# EAGLE schematic OBCv1_18_2_12 - Copy (EAGLE 5.10)
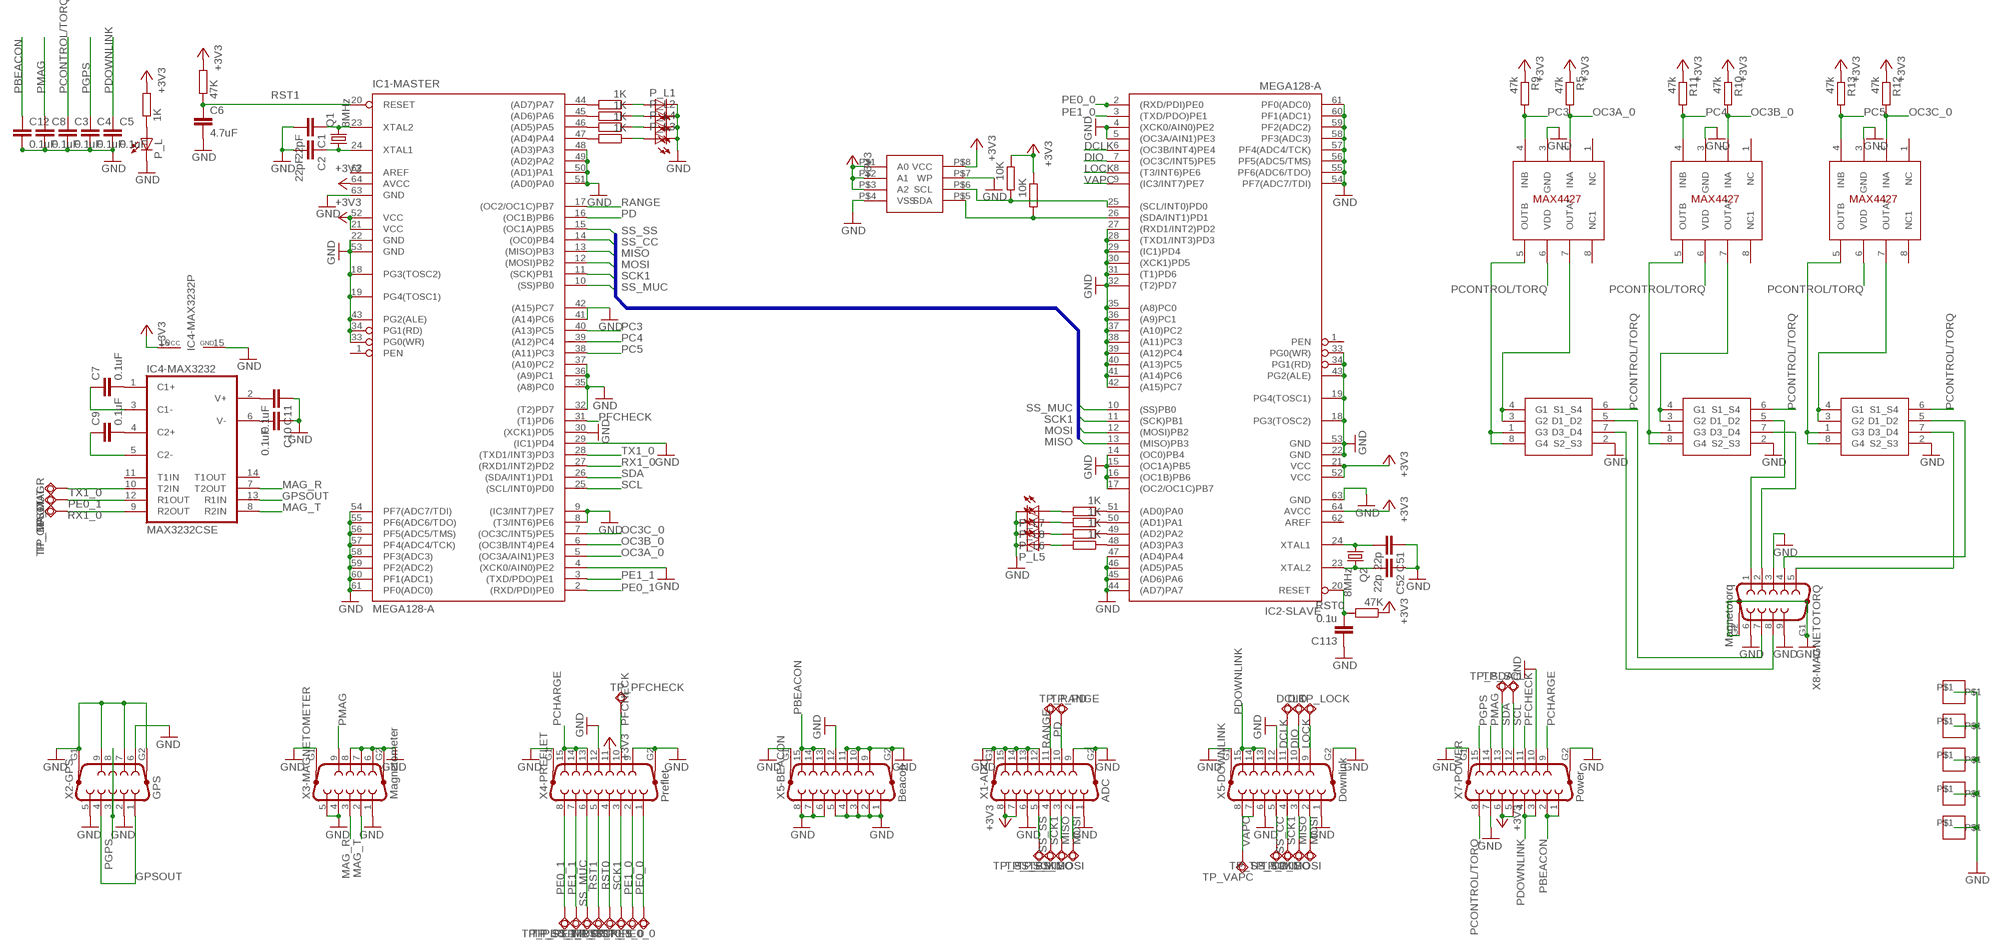
[diagram p0: schematic, sheet 1]

## Parts
C1  22pF  C-EUC1206  [C1206]
C2  22pF  C-EUC1206  [C1206]
C3  0.1uF  C-EUC1206  [C1206]
C4  0.1uF  C-EUC1206  [C1206]
C5  0.1uF  C-EUC1206  [C1206]
C6  4.7uF  C-EUC1206  [C1206]
C7  0.1uF  C-EUC1206  [C1206]
C8  0.1uF  C-EUC1206  [C1206]
C9  0.1uF  C-EUC1206  [C1206]
C10  0.1uF  C-EUC1206  [C1206]
C11  0.1uF  C-EUC1206  [C1206]
C12  0.1uF  C-EUC1206  [C1206]
C51  22p  C-EUC1206  [C1206]
C52  22p  C-EUC1206  [C1206]
C113  0.1u  C-EUC1206  [C1206]
DCLK  TPSQTP12R  [TP12R]
DIO  TPSQTP12R  [TP12R]
IC1-MASTER  MEGA128-A  [TQFP64]
IC2-SLAVE  MEGA128-A  [TQFP64]
IC3-EEPROM  24FC1025  [24FC1025]
IC4-MAX3232  MAX3232CSE  [SO16]
IC5  MAX4427SO  [SO08]
IC6  MAX4427SO  [SO08]
IC7  MAX4427SO  [SO08]
IC8  ZXMHC3A01T8  [SM8]
IC9  ZXMHC3A01T8  [SM8]
IC10  ZXMHC3A01T8  [SM8]
P_L  LEDCHIPLED_1206  [CHIPLED_1206]
P_L1  LEDCHIPLED_1206  [CHIPLED_1206]
P_L2  LEDCHIPLED_1206  [CHIPLED_1206]
P_L3  LEDCHIPLED_1206  [CHIPLED_1206]
P_L4  LEDCHIPLED_1206  [CHIPLED_1206]
P_L5  LEDCHIPLED_1206  [CHIPLED_1206]
P_L6  LEDCHIPLED_1206  [CHIPLED_1206]
P_L7  LEDCHIPLED_1206  [CHIPLED_1206]
P_L8  LEDCHIPLED_1206  [CHIPLED_1206]
P_R  1K  R-EU_M1206  [M1206]
P_R1  1K  R-EU_M1206  [M1206]
P_R2  1K  R-EU_M1206  [M1206]
P_R3  1K  R-EU_M1206  [M1206]
P_R4  1K  R-EU_M1206  [M1206]
P_R5  1K  R-EU_M1206  [M1206]
P_R6  1K  R-EU_M1206  [M1206]
P_R7  1K  R-EU_M1206  [M1206]
P_R8  1K  R-EU_M1206  [M1206]
Q1  8MHz  CRYSTALHC49S  [HC49/S]
Q2  8MHz  CRYSTALHC49S  [HC49/S]
R5  47k  R-EU_M1206  [M1206]
R9  47k  R-EU_M1206  [M1206]
R10  47k  R-EU_M1206  [M1206]
R11  47k  R-EU_M1206  [M1206]
R12  47k  R-EU_M1206  [M1206]
R13  47k  R-EU_M1206  [M1206]
R51  10K  R-EU_M1206  [M1206]
R52  10K  R-EU_M1206  [M1206]
R53  47K  R-EU_M1206  [M1206]
R113  47K  R-EU_M1206  [M1206]
TP__MISO  TPSQTP12R  [TP12R]
TP__MOSI  TPSQTP12R  [TP12R]
TP__SCK1  TPSQTP12R  [TP12R]
TP_GPSOUT  TPSQTP12R  [TP12R]
TP_LOCK  TPSQTP12R  [TP12R]
TP_MAGR  TPSQTP12R  [TP12R]
TP_MAGT  TPSQTP12R  [TP12R]
TP_MISO  TPSQTP12R  [TP12R]
TP_MOSI  TPSQTP12R  [TP12R]
TP_PD  TPSQTP12R  [TP12R]
TP_PE0_0  TPSQTP12R  [TP12R]
TP_PE0_1  TPSQTP12R  [TP12R]
TP_PE1_0  TPSQTP12R  [TP12R]
TP_PE1_1  TPSQTP12R  [TP12R]
TP_PFCHECK  TPSQTP12R  [TP12R]
TP_RANGE  TPSQTP12R  [TP12R]
TP_RST0  TPSQTP12R  [TP12R]
TP_RST1  TPSQTP12R  [TP12R]
TP_SCK1  TPSQTP12R  [TP12R]
TP_SCK_S  TPSQTP12R  [TP12R]
TP_SCL  TPSQTP12R  [TP12R]
TP_SDA  TPSQTP12R  [TP12R]
TP_SS_CC  TPSQTP12R  [TP12R]
TP_SS_MUC  TPSQTP12R  [TP12R]
TP_SS_SS  TPSQTP12R  [TP12R]
TP_VAPC  TPSQTP12R  [TP12R]
U$1  MOUNT_SQ  [MOUNT_10MM]
U$9  MOUNT_SQ  [MOUNT_10MM]
U$10  MOUNT_SQ  [MOUNT_10MM]
U$11  MOUNT_SQ  [MOUNT_10MM]
U$12  MOUNT_SQ  [MOUNT_10MM]
X1-ADC  ADC  F15HP  [F15HP]
X2-GPS  GPS  F09HP  [F09HP]
X3-MAGNETOMETER  Magnetometer  F09HP  [F09HP]
X4-PREFLET  Preflet  F15HP  [F15HP]
X5-BEACON  Beacon  F15HP  [F15HP]
X5-DOWNLINK  Downlink  F15HP  [F15HP]
X7-POWER  Power  F15HP  [F15HP]
X8-MAGNETOTORQ  Magnetotorq  F09HP  [F09HP]

## Nets
+3V3 [Power]: IC1-MASTER.21(VCC) IC1-MASTER.52(VCC) IC1-MASTER.64(AVCC) IC2-SLAVE.21(VCC) IC2-SLAVE.52(VCC) IC2-SLAVE.64(AVCC) IC3-EEPROM.P$1(A0) IC3-EEPROM.P$2(A1) IC3-EEPROM.P$3(A2) IC3-EEPROM.P$8(VCC) IC4-MAX3232.16(VCC) P_R.2 R5.1 R9.1 R10.1 R11.1 R12.1 R13.1 R51.1 R52.1 R53.2 R113.1 X1-ADC.7 X1-ADC.8 X4-PREFLET.11 X7-POWER.5 X7-POWER.6
DCLK: DCLK.TP IC2-SLAVE.6((OC3B/INT4)PE4) X5-DOWNLINK.11
DIO: DIO.TP IC2-SLAVE.7((OC3C/INT5)PE5) X5-DOWNLINK.10
GND [Power]: C1.2 C2.2 C3.2 C4.2 C5.2 C6.2 C8.2 C10.1 C11.1 C12.2 C51.1 C52.1 C113.1 IC1-MASTER.4((XCK0/AIN0)PE2) IC1-MASTER.8((T3/INT6)PE6) IC1-MASTER.9((IC3/INT7)PE7) IC1-MASTER.18(PG3(TOSC2)) IC1-MASTER.19(PG4(TOSC1)) IC1-MASTER.22(GND) IC1-MASTER.29((IC1)PD4) IC1-MASTER.30((XCK1)PD5) IC1-MASTER.32((T2)PD7) IC1-MASTER.33(PG0(WR)) IC1-MASTER.34(PG1(RD)) IC1-MASTER.35((A8)PC0) IC1-MASTER.36((A9)PC1) IC1-MASTER.37((A10)PC2) IC1-MASTER.41((A14)PC6) IC1-MASTER.42((A15)PC7) IC1-MASTER.43(PG2(ALE)) IC1-MASTER.48((AD3)PA3) IC1-MASTER.49((AD2)PA2) IC1-MASTER.50((AD1)PA1) IC1-MASTER.51((AD0)PA0) IC1-MASTER.53(GND) IC1-MASTER.54(PF7(ADC7/TDI)) IC1-MASTER.55(PF6(ADC6/TDO)) IC1-MASTER.56(PF5(ADC5/TMS)) IC1-MASTER.57(PF4(ADC4/TCK)) IC1-MASTER.58(PF3(ADC3)) IC1-MASTER.59(PF2(ADC2)) IC1-MASTER.60(PF1(ADC1)) IC1-MASTER.61(PF0(ADC0)) IC1-MASTER.63(GND) IC2-SLAVE.4((XCK0/AIN0)PE2) IC2-SLAVE.5((OC3A/AIN1)PE3) IC2-SLAVE.14((OC0)PB4) IC2-SLAVE.15((OC1A)PB5) IC2-SLAVE.16((OC1B)PB6) IC2-SLAVE.17((OC2/OC1C)PB7) IC2-SLAVE.18(PG3(TOSC2)) IC2-SLAVE.19(PG4(TOSC1)) IC2-SLAVE.22(GND) IC2-SLAVE.27((RXD1/INT2)PD2) IC2-SLAVE.28((TXD1/INT3)PD3) IC2-SLAVE.29((IC1)PD4) IC2-SLAVE.30((XCK1)PD5) IC2-SLAVE.31((T1)PD6) IC2-SLAVE.32((T2)PD7) IC2-SLAVE.33(PG0(WR)) IC2-SLAVE.34(PG1(RD)) IC2-SLAVE.35((A8)PC0) IC2-SLAVE.36((A9)PC1) IC2-SLAVE.37((A10)PC2) IC2-SLAVE.38((A11)PC3) IC2-SLAVE.39((A12)PC4) IC2-SLAVE.40((A13)PC5) IC2-SLAVE.41((A14)PC6) IC2-SLAVE.42((A15)PC7) IC2-SLAVE.43(PG2(ALE)) IC2-SLAVE.44((AD7)PA7) IC2-SLAVE.45((AD6)PA6) IC2-SLAVE.46((AD5)PA5) IC2-SLAVE.47((AD4)PA4) IC2-SLAVE.53(GND) IC2-SLAVE.54(PF7(ADC7/TDI)) IC2-SLAVE.55(PF6(ADC6/TDO)) IC2-SLAVE.56(PF5(ADC5/TMS)) IC2-SLAVE.57(PF4(ADC4/TCK)) IC2-SLAVE.58(PF3(ADC3)) IC2-SLAVE.59(PF2(ADC2)) IC2-SLAVE.60(PF1(ADC1)) IC2-SLAVE.61(PF0(ADC0)) IC2-SLAVE.63(GND) IC3-EEPROM.P$4(VSS) IC3-EEPROM.P$7(WP) IC4-MAX3232.15(GND) IC5.3(GND) IC6.3(GND) IC7.3(GND) IC8.2(S2_S3) IC9.2(S2_S3) IC10.2(S2_S3) P_L1.C P_L2.C P_L3.C P_L4.C P_L5.C P_L6.C P_L7.C P_L8.C P_L.C U$1.P$1 U$9.P$1 U$10.P$1 U$11.P$1 U$12.P$1 X1-ADC.1 X1-ADC.6 X1-ADC.9 X1-ADC.12 X1-ADC.13 X1-ADC.14 X1-ADC.15 X1-ADC.G1 X1-ADC.G2 X2-GPS.2 X2-GPS.5 X2-GPS.6 X2-GPS.7 X2-GPS.9 X2-GPS.G1 X2-GPS.G2 X3-MAGNETOMETER.1 X3-MAGNETOMETER.4 X3-MAGNETOMETER.5 X3-MAGNETOMETER.6 X3-MAGNETOMETER.7 X3-MAGNETOMETER.8 X3-MAGNETOMETER.G1 X3-MAGNETOMETER.G2 X4-PREFLET.9 X4-PREFLET.12 X4-PREFLET.G1 X4-PREFLET.G2 X5-BEACON.1 X5-BEACON.2 X5-BEACON.3 X5-BEACON.4 X5-BEACON.5 X5-BEACON.6 X5-BEACON.7 X5-BEACON.8 X5-BEACON.9 X5-BEACON.10 X5-BEACON.11 X5-BEACON.12 X5-BEACON.G1 X5-BEACON.G2 X5-DOWNLINK.1 X5-DOWNLINK.6 X5-DOWNLINK.12 X5-DOWNLINK.G1 X5-DOWNLINK.G2 X7-POWER.7 X7-POWER.10 X7-POWER.G1 X7-POWER.G2 X8-MAGNETOTORQ.3 X8-MAGNETOTORQ.6 X8-MAGNETOTORQ.9 X8-MAGNETOTORQ.G1 X8-MAGNETOTORQ.G2
GPSOUT: IC4-MAX3232.13(R1IN) X2-GPS.1 X2-GPS.4
LOCK: IC2-SLAVE.8((T3/INT6)PE6) TP_LOCK.TP X5-DOWNLINK.9
MAG_R: IC4-MAX3232.7(T2OUT) X3-MAGNETOMETER.3
MAG_T: IC4-MAX3232.8(R2IN) X3-MAGNETOMETER.2
MISO: IC1-MASTER.13((MISO)PB3) IC2-SLAVE.13((MISO)PB3) TP__MISO.TP TP_MISO.TP X1-ADC.3 X5-DOWNLINK.3
MOSI: IC1-MASTER.12((MOSI)PB2) IC2-SLAVE.12((MOSI)PB2) TP__MOSI.TP TP_MOSI.TP X1-ADC.2 X5-DOWNLINK.2
N$1: C1.1 IC1-MASTER.23(XTAL2) Q1.2
N$2: C2.1 IC1-MASTER.24(XTAL1) Q1.1
N$3: P_L.A P_R.1
N$8: P_L1.A P_R1.1
N$9: IC1-MASTER.44((AD7)PA7) P_R1.2
N$10: IC1-MASTER.45((AD6)PA6) P_R2.2
N$11: IC5.7(OUTA*) IC8.3(G2) IC8.4(G1)
N$12: C52.2 IC2-SLAVE.23(XTAL2) Q2.2
N$13: C51.2 IC2-SLAVE.24(XTAL1) Q2.1
N$15: IC7.5(OUTB) IC10.1(G3) IC10.8(G4)
N$19: IC2-SLAVE.25((SCL/INT0)PD0) IC3-EEPROM.P$6(SCL) R52.2
N$20: IC2-SLAVE.26((SDA/INT1)PD1) IC3-EEPROM.P$5(SDA) R51.2
N$21: P_L2.A P_R2.1
N$22: IC1-MASTER.46((AD5)PA5) P_R3.2
N$23: P_L4.A P_R3.1
N$24: IC1-MASTER.47((AD4)PA4) P_R4.2
N$25: P_L3.A P_R4.1
N$26: P_L7.A P_R5.2
N$27: IC2-SLAVE.51((AD0)PA0) P_R5.1
N$28: IC2-SLAVE.50((AD1)PA1) P_R6.1
N$29: C7.2 IC4-MAX3232.1(C1+)
N$30: C7.1 IC4-MAX3232.3(C1-)
N$31: C9.2 IC4-MAX3232.4(C2+)
N$32: C9.1 IC4-MAX3232.5(C2-)
N$33: C11.2 IC4-MAX3232.2(V+)
N$34: C10.2 IC4-MAX3232.6(V-)
N$35: P_L8.A P_R6.2
N$36: IC2-SLAVE.49((AD2)PA2) P_R7.1
N$37: P_L6.A P_R7.2
N$38: IC2-SLAVE.48((AD3)PA3) P_R8.1
N$39: P_L5.A P_R8.2
N$44: IC8.5(D1_D2) X8-MAGNETOTORQ.7
N$50: IC8.7(D3_D4) X8-MAGNETOTORQ.8
N$51: IC5.5(OUTB) IC8.1(G3) IC8.8(G4)
N$52: IC6.7(OUTA*) IC9.3(G2) IC9.4(G1)
N$56: IC9.5(D1_D2) X8-MAGNETOTORQ.1
N$57: IC9.7(D3_D4) X8-MAGNETOTORQ.2
N$61: IC6.5(OUTB) IC9.1(G3) IC9.8(G4)
N$62: IC7.7(OUTA*) IC10.3(G2) IC10.4(G1)
N$66: IC10.5(D1_D2) X8-MAGNETOTORQ.4
N$67: IC10.7(D3_D4) X8-MAGNETOTORQ.5
OC3A_0: IC1-MASTER.5((OC3A/AIN1)PE3) IC5.2(INA) R5.2
OC3B_0: IC1-MASTER.6((OC3B/INT4)PE4) IC6.2(INA) R10.2
OC3C_0: IC1-MASTER.7((OC3C/INT5)PE5) IC7.2(INA) R12.2
PBEACON [Power]: C12.1 X5-BEACON.13 X5-BEACON.14 X5-BEACON.15 X7-POWER.1 X7-POWER.2
PC3: IC1-MASTER.40((A13)PC5) IC5.4(INB) R9.2
PC4: IC1-MASTER.39((A12)PC4) IC6.4(INB) R11.2
PC5: IC1-MASTER.38((A11)PC3) IC7.4(INB) R13.2
PCHARGE [Power]: X4-PREFLET.13 X4-PREFLET.14 X4-PREFLET.15 X7-POWER.9
PCONTROL/TORQ [Power]: C3.1 IC5.6(VDD) IC6.6(VDD) IC7.6(VDD) IC8.6(S1_S4) IC9.6(S1_S4) IC10.6(S1_S4) X7-POWER.8
PD: IC1-MASTER.16((OC1B)PB6) TP_PD.TP X1-ADC.10
PDOWNLINK [Power]: C5.1 X5-DOWNLINK.13 X5-DOWNLINK.14 X5-DOWNLINK.15 X7-POWER.3 X7-POWER.4
PE0_0: IC2-SLAVE.2((RXD/PDI)PE0) TP_PE0_0.TP X4-PREFLET.1
PE0_1: IC1-MASTER.2((RXD/PDI)PE0) IC4-MAX3232.12(R1OUT) TP_GPSOUT.TP TP_PE0_1.TP X4-PREFLET.8
PE1_0: IC2-SLAVE.3((TXD/PDO)PE1) TP_PE1_0.TP X4-PREFLET.2
PE1_1: IC1-MASTER.3((TXD/PDO)PE1) TP_PE1_1.TP X4-PREFLET.7
PFCHECK: IC1-MASTER.31((T1)PD6) TP_PFCHECK.TP X4-PREFLET.10 X7-POWER.11
PGPS [Power]: C4.1 X2-GPS.3 X2-GPS.8 X7-POWER.15
PMAG [Power]: C8.1 X3-MAGNETOMETER.9 X7-POWER.14
RANGE: IC1-MASTER.17((OC2/OC1C)PB7) TP_RANGE.TP X1-ADC.11
RST0: C113.2 IC2-SLAVE.20(RESET) R113.2 TP_RST0.TP X4-PREFLET.4
RST1: C6.1 IC1-MASTER.20(RESET) R53.1 TP_RST1.TP X4-PREFLET.5
RX1_0: IC1-MASTER.27((RXD1/INT2)PD2) IC4-MAX3232.9(R2OUT) TP_MAGT.TP
SCK1: IC1-MASTER.11((SCK)PB1) IC2-SLAVE.11((SCK)PB1) TP__SCK1.TP TP_SCK1.TP TP_SCK_S.TP X1-ADC.4 X4-PREFLET.3 X5-DOWNLINK.4
SCL: IC1-MASTER.25((SCL/INT0)PD0) TP_SCL.TP X7-POWER.12
SDA: IC1-MASTER.26((SDA/INT1)PD1) TP_SDA.TP X7-POWER.13
SS_CC: IC1-MASTER.14((OC0)PB4) TP_SS_CC.TP X5-DOWNLINK.5
SS_MUC: IC1-MASTER.10((SS)PB0) IC2-SLAVE.10((SS)PB0) TP_SS_MUC.TP X4-PREFLET.6
SS_SS: IC1-MASTER.15((OC1A)PB5) TP_SS_SS.TP X1-ADC.5
TX1_0: IC1-MASTER.28((TXD1/INT3)PD3) IC4-MAX3232.10(T2IN) TP_MAGR.TP
VAPC: IC2-SLAVE.9((IC3/INT7)PE7) TP_VAPC.TP X5-DOWNLINK.7 X5-DOWNLINK.8
Unconnected: IC1-MASTER.1(PEN) IC1-MASTER.62(AREF) IC2-SLAVE.1(PEN) IC2-SLAVE.62(AREF) IC4-MAX3232.11(T1IN) IC4-MAX3232.14(T1OUT) IC5.1(NC) IC5.8(NC1) IC6.1(NC) IC6.8(NC1) IC7.1(NC) IC7.8(NC1)

## Buses
SS_SS,SCK1,MOSI,MISO,SS_MUC,SS_CC

## Library data of the parts
C1-C12 C51 C52 C113 = rcl:C-EU: CAPACITOR, European symbol
DCLK DIO TP__MISO TP__MOSI TP__SCK1 TP_GPSOUT TP_LOCK TP_MAGR TP_MAGT TP_MISO TP_MOSI TP_PD TP_PE0_0 TP_PE0_1 TP_PE1_0 TP_PE1_1 TP_PFCHECK TP_RANGE TP_RST0 TP_RST1 TP_SCK1 TP_SCK_S TP_SCL TP_SDA TP_SS_CC TP_SS_MUC TP_SS_SS TP_VAPC = testpad:TPSQ: Test pad
IC1-MASTER IC2-SLAVE = satellite:MEGA128: MICROCONTROLLER 128 Kbytes FLASH 4 Kbytes SRAM 4 Kbytes EEPROM DUAL USART 8-channel 10 bit ADC Source: avr.lbr
IC3-EEPROM = satellite:24FC1025
IC4-MAX3232 = satellite:MAX3232*: True RS-232 Transceivers 3.0V to 5.5V, Low-Power up to 1Mbps, Using Four 0.1µF External Capacitors Source: http://pdfserv.maxim-ic.com/en/ds/MAX3222-MAX3241.pdf
IC5-IC7 = satellite:MAX4427
IC8-IC10 = satellite:ZXMHC3A01T8
P_L P_L1-P_L8 = satellite:LED: LED OSRAM: - CHIPLED LG R971, LG N971, LY N971, LG Q971, LY Q971, LO R971, LY R971 LH N974, LH R974 LS Q976, LO Q976, LY Q976 LO Q996 - Hyper CHIPLED LW Q18S LB Q993, LB Q99A, LB R99A - SideLED LS A670, LO A670, LY A670, LG A670, LP A670 LB A673, LV A673, LT A673, LW A673 LH A674 LY A675 LS A676, LA A676, LO A676, LY A676, LW A676 LS A679, LY A679, LG A679 - Hyper Micro SIDELED® LS Y876, LA Y876, LO Y876, LY Y876 LT Y87S - SmartLED LW L88C, LW L88S LB L89C, LB L89S, LG L890 LS L89K, LO L89K, LY L89K LS L896, LA L896, LO L896, LY L896 - TOPLED LS T670, LO T670, LY T670, LG T670, LP T670 LSG T670, LSP T670, LSY T670, LOP T670, LYG T670 LG T671, LOG T671, LSG T671 LB T673, LV T673, LT T673, LW T673 LH T674 LS T676, LA T676, LO T676, LY T676, LB T676, LH T676, LSB T676, LW T676 LB T67C, LV T67C, LT T67C, LS T67K, LO T67K, LY T67K, LW E67C LS E67B, LA E67B, LO E67B, LY E67B, LB E67C, LV E67C, LT E67C LW T67C LS T679, LY T679, LG T679 LS T770, LO T770, LY T770, LG T770, LP T770 LB T773, LV T773, LT T773, LW T773 LH T774 LS E675, LA E675, LY E675, LS T675 LS T776, LA T776, LO T776, LY T776, LB T776 LHGB T686 LT T68C, LB T68C - Hyper Mini TOPLED® LB M676 - Mini TOPLED Santana® LG M470 LS M47K, LO M47K, LY M47K Source: http://www.osram.convergy.de LUXEON: - LUMILED® LXK2-PW12-R00, LXK2-PW12-S00, LXK2-PW14-U00, LXK2-PW14-V00 LXK2-PM12-R00, LXK2-PM12-S00, LXK2-PM14-U00 LXK2-PE12-Q00, LXK2-PE12-R00, LXK2-PE12-S00, LXK2-PE14-T00, LXK2-PE14-U00 LXK2-PB12-K00, LXK2-PB12-L00, LXK2-PB12-M00, LXK2-PB14-N00, LXK2-PB14-P00, LXK2-PB14-Q00 LXK2-PR12-L00, LXK2-PR12-M00, LXK2-PR14-Q00, LXK2-PR14-R00 LXK2-PD12-Q00, LXK2-PD12-R00, LXK2-PD12-S00 LXK2-PH12-R00, LXK2-PH12-S00 LXK2-PL12-P00, LXK2-PL12-Q00, LXK2-PL12-R00 Source: www.luxeon.com KINGBRIGHT: KA-3528ASYC Source: www.kingbright.com
P_R P_R1-P_R8 R51-R53 R113 = resistor:R-EU_: RESISTOR, European symbol
Q1 Q2 = crystal:CRYSTAL: CRYSTAL
R5 R9-R13 = rcl:R-EU_: RESISTOR, European symbol
U$1 U$9-U$12 = satellite:MOUNT_SQ
X1-ADC X4-PREFLET X5-BEACON X5-DOWNLINK X7-POWER = satellite:F15HP: SUB-D
X2-GPS X3-MAGNETOMETER X8-MAGNETOTORQ = satellite:F09HP: SUB-D

## Net classes
0 Signal: width 0.254 mm, clearance 0.254 mm
1 Power: width 0.254 mm, clearance 0.508 mm to class 0, clearance 0.508 mm